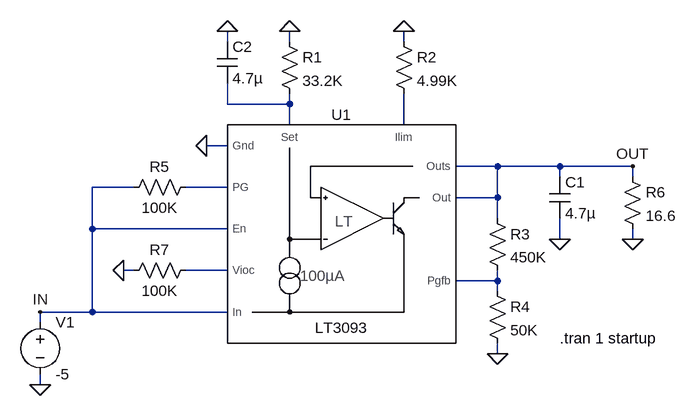
[diagram p0: schematic 3093.asc]
3093.asc, the LTspice schematic file:
Version 4
SHEET 1 1004 680
WIRE 80 -96 80 -112
WIRE 176 -96 176 -112
WIRE 352 -96 352 -112
WIRE 80 0 80 -32
WIRE 176 0 176 -16
WIRE 176 0 80 0
WIRE 176 32 176 0
WIRE 352 32 352 -16
WIRE 80 64 48 64
WIRE 496 96 432 96
WIRE 592 96 496 96
WIRE 704 96 592 96
WIRE 592 112 592 96
WIRE 704 112 704 96
WIRE -64 128 -128 128
WIRE 80 128 16 128
WIRE 496 144 496 96
WIRE 496 144 432 144
WIRE 496 176 496 144
WIRE -128 192 -128 128
WIRE 80 192 -128 192
WIRE 592 208 592 176
WIRE 704 208 704 192
WIRE -64 256 -80 256
WIRE 80 256 16 256
WIRE 496 272 496 256
WIRE 496 272 432 272
WIRE 496 288 496 272
WIRE -128 320 -128 192
WIRE -128 320 -208 320
WIRE 80 320 -128 320
WIRE -208 336 -208 320
WIRE 496 384 496 368
WIRE -208 432 -208 416
FLAG 496 384 0
FLAG -208 432 0
FLAG 48 64 0
FLAG 176 -112 0
FLAG 352 -112 0
FLAG 704 208 0
FLAG 592 208 0
FLAG 80 -112 0
FLAG -80 256 0
FLAG -208 320 IN
FLAG 704 96 OUT
SYMBOL voltage -208 320 R0
WINDOW 123 0 0 Left 0
WINDOW 39 0 0 Left 0
SYMATTR InstName V1
SYMATTR Value -5
SYMBOL res 160 -112 R0
SYMATTR InstName R1
SYMATTR Value 33.2K
SYMBOL res 336 -112 R0
SYMATTR InstName R2
SYMATTR Value 4.99K
SYMBOL res 480 160 R0
SYMATTR InstName R3
SYMATTR Value 450K
SYMBOL res 480 272 R0
SYMATTR InstName R4
SYMATTR Value 50K
SYMBOL res 32 112 R90
WINDOW 0 0 56 VBottom 2
WINDOW 3 32 56 VTop 2
SYMATTR InstName R5
SYMATTR Value 100K
SYMBOL res 688 96 R0
SYMATTR InstName R6
SYMATTR Value 16.6
SYMBOL cap 576 112 R0
SYMATTR InstName C1
SYMATTR Value 4.7µ
SYMATTR SpiceLine Rser=10m Lser=1n
SYMBOL cap 64 -96 R0
SYMATTR InstName C2
SYMATTR Value 4.7µ
SYMBOL res 32 240 R90
WINDOW 0 0 56 VBottom 2
WINDOW 3 32 56 VTop 2
SYMATTR InstName R7
SYMATTR Value 100K
SYMBOL LT3093 256 144 R0
SYMATTR InstName U1
TEXT 592 360 Left 2 !.tran 1 startup

The netlist it stands for:
* 3093.asc
V1 IN 0 -5
R1 0 N001 33.2K
R2 0 N002 4.99K
R3 OUT N005 450K
R4 N005 0 50K
R5 N003 IN 100K
R6 OUT 0 16.6
C1 OUT 0 4.7µ Rser=10m Lser=1n
C2 0 N001 4.7µ
R7 N004 0 100K
XU1 IN IN N003 N005 N002 N004 N001 0 OUT OUT LT3093  ; pins In En PG Pgfb Ilim Vioc Set Gnd Outs Out
.tran 1 startup
.lib LT3093.sub
.backanno
.end